# EAGLE design TempAndHumiditySensor (EAGLE 7.1.0)
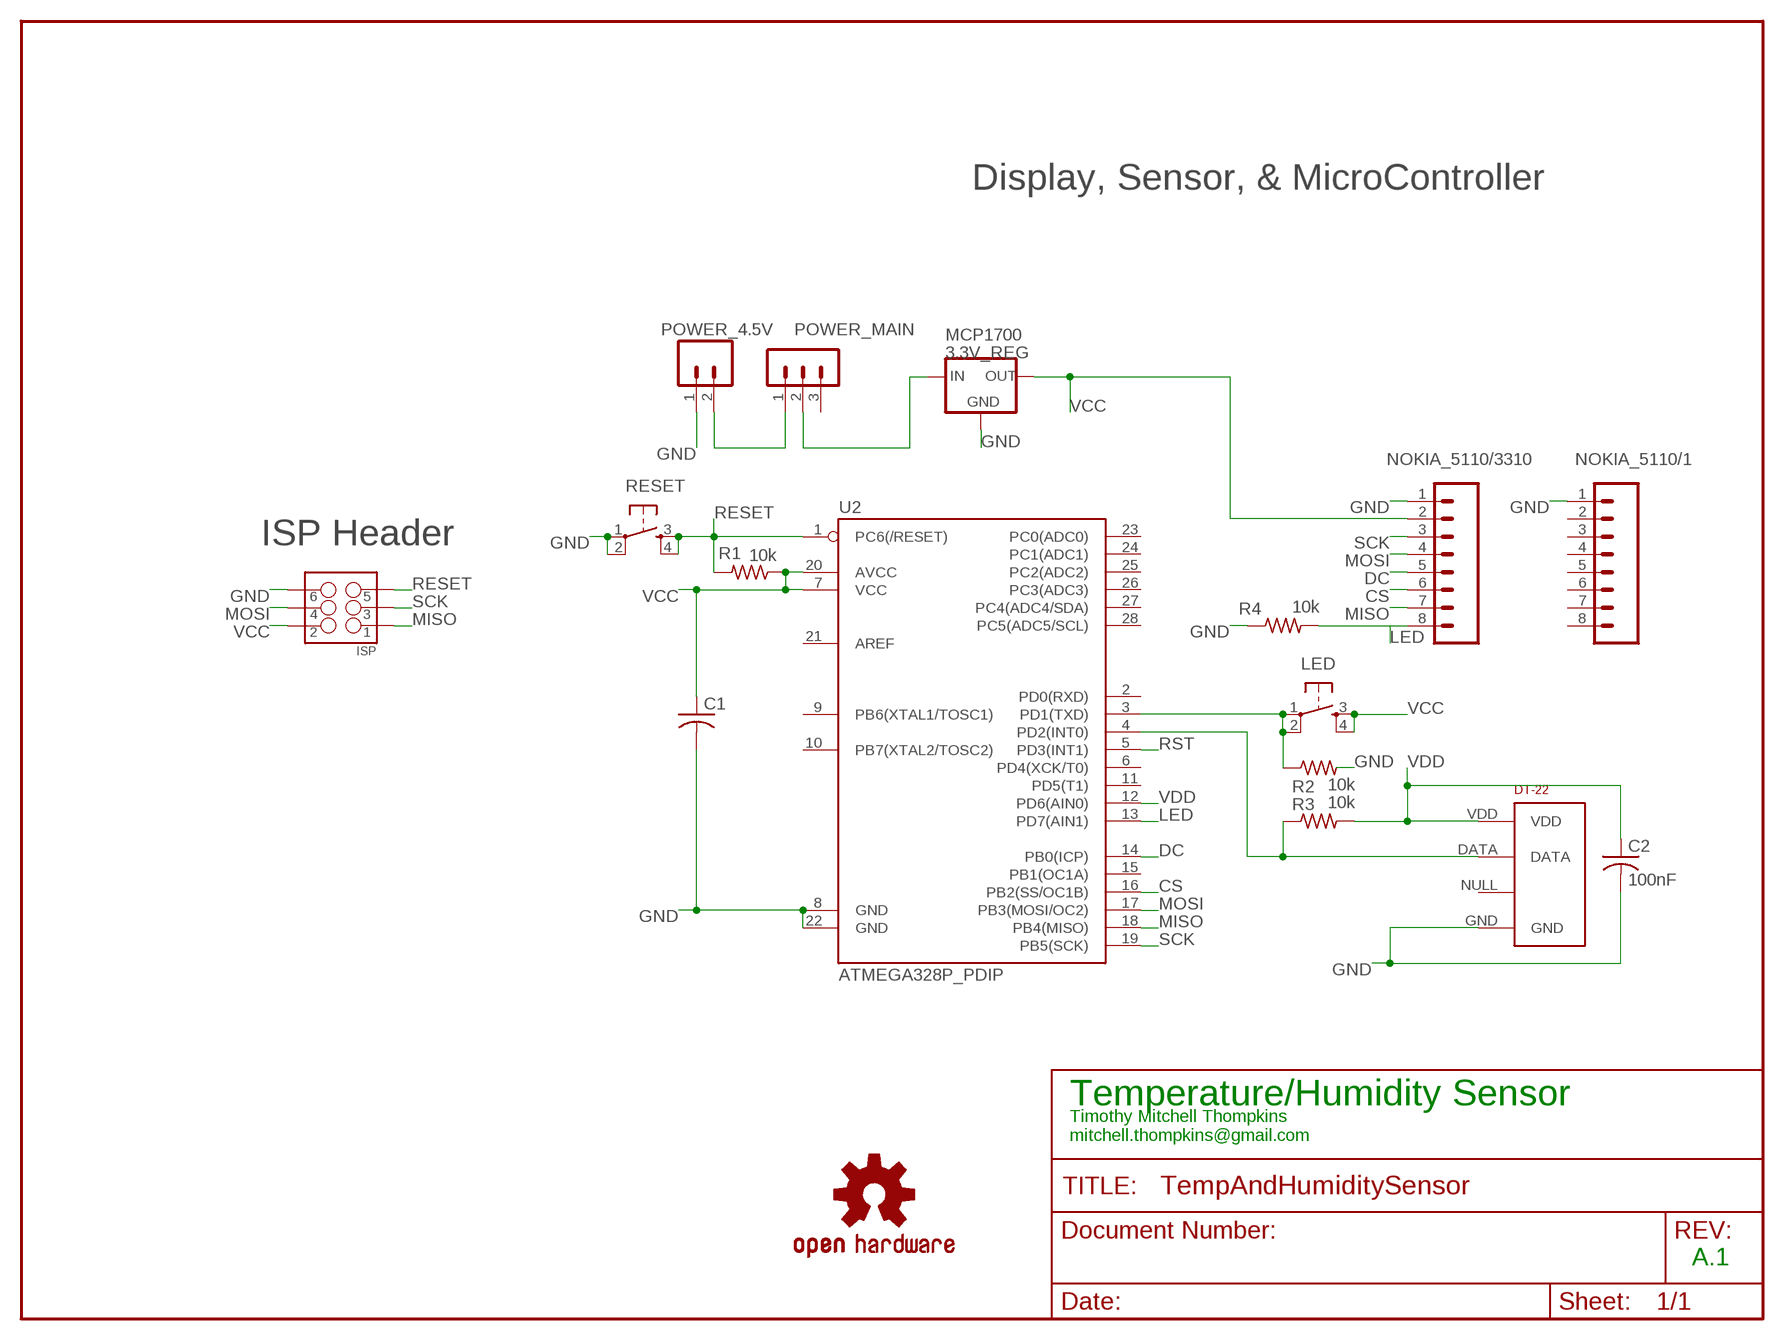
[diagram p0: schematic, sheet 1]

## Parts
C1  C-US025-040X050  [C025-040X050]
C2  100nF  C-US025-040X050  [C025-040X050]
DT-22  RHT03_DHT-22_AM2302RA  [RHT03_DHT-22/RA]
ISP  M03X2POGO_PINS  [2X3_POGO]
LED  RESET  TAC_SWITCHPTH  [TACTILE-PTH]
LOGO2  OSHW-LOGOS  [OSHW-LOGO-S]
MCP1700  3.3V_REG  MCP1700INLINE  [TO92-INLINE]
NOKIA_5110/1  M08  [1X08_PIN1_NO_SILK]
NOKIA_5110/3310  M08  [1X08_PIN1_NO_SILK]
POWER_4.5V  M02LOCK_LONGPADS  [1X02_LOCK_LONGPADS]
POWER_MAIN  MA03-1  [MA03-1]
R1  10k  R-US_0204/7  [0204/7]
R2  10k  R-US_0204/7  [0204/7]
R3  10k  R-US_0204/7  [0204/7]
R4  10k  R-US_0204/7  [0204/7]
RESET  RESET  TAC_SWITCHPTH  [TACTILE-PTH]
U2  ATMEGA328P_PDIP  [DIL28-3]

## Nets
CS: NOKIA_5110/3310.6 U2.16(PB2(SS/OC1B))
DC: NOKIA_5110/3310.5 U2.14(PB0(ICP))
GND: C1.2 C2.2 DT-22.GND ISP.P$6 MCP1700.1(GND) NOKIA_5110/1.1 NOKIA_5110/3310.1 POWER_4.5V.1 R2.2 R4.1 RESET.1 RESET.2 U2.8(GND) U2.22(GND)
LED: NOKIA_5110/3310.8 R4.2 U2.13(PD7(AIN1))
MISO: ISP.P$1 NOKIA_5110/3310.7 U2.18(PB4(MISO))
MOSI: ISP.P$4 NOKIA_5110/3310.4 U2.17(PB3(MOSI/OC2))
N$1: POWER_4.5V.2 POWER_MAIN.1
N$2: MCP1700.2(IN) POWER_MAIN.2
N$4: LED.1 LED.2 R2.1 U2.3(PD1(TXD))
N$5: DT-22.DATA R3.1 U2.4(PD2(INT0))
RESET: ISP.P$5 R1.2 RESET.3 RESET.4 U2.1(PC6(/RESET))
RST: U2.5(PD3(INT1))
SCK: ISP.P$3 NOKIA_5110/3310.3 U2.19(PB5(SCK))
VCC: C1.1 ISP.P$2 LED.3 LED.4 MCP1700.3(OUT) NOKIA_5110/3310.2 R1.1 U2.7(VCC) U2.20(AVCC)
VDD: C2.1 DT-22.VDD R3.2 U2.12(PD6(AIN0))
Unconnected: DT-22.NULL NOKIA_5110/1.2 NOKIA_5110/1.3 NOKIA_5110/1.4 NOKIA_5110/1.5 NOKIA_5110/1.6 NOKIA_5110/1.7 NOKIA_5110/1.8 POWER_MAIN.3 U2.2(PD0(RXD)) U2.6(PD4(XCK/T0)) U2.9(PB6(XTAL1/TOSC1)) U2.10(PB7(XTAL2/TOSC2)) U2.11(PD5(T1)) U2.15(PB1(OC1A)) U2.21(AREF) U2.23(PC0(ADC0)) U2.24(PC1(ADC1)) U2.25(PC2(ADC2)) U2.26(PC3(ADC3)) U2.27(PC4(ADC4/SDA)) U2.28(PC5(ADC5/SCL))

## Notes on the sheet
- Display, Sensor, & MicroController
- ISP Header
- Temperature/Humidity Sensor
- Timothy Mitchell Thompkins
  mitchell.thompkins@gmail.com
- A.1

## Library data of the parts
C1 C2 = adafruit:C-US: CAPACITOR, American symbol
DT-22 = DHT-22:RHT03_DHT-22_AM2302: RHT03 / DHT-22 / AM2302 Packages and symbol for the RHT03 / DHT-22 relative humidity and temperature sensor. Note: The AM2302 is a wired version of the DHT-22 which typically requires less clearance and is thus provided as a separate package.; PROD_ID: SEN-10167
ISP = SparkFun-Connectors:M03X2: 2x3 .1" header. Shrouded, with keying- CONN-10681 SMT- CONN-11415 Pogo pins- HW-11044; PROD_ID: HW-11044
LED RESET = SparkFun:TAC_SWITCH: Momentary Switch Button commonly used for reset or general input. Spark Fun Electronics SKU : COM-00097
LOGO2 = SparkFun-Aesthetics:OSHW-LOGO: Open Source Hardware Logo This logo indicates the piece of hardware it is found on incorporates a OSHW license and/or adheres to the definition of open source hardware found here: http://freedomdefined.org/OSHW
MCP1700 = adafruit:MCP1700: VOLTAGE REGULATOR
NOKIA_5110/1 NOKIA_5110/3310 = SparkFun-Connectors:M08: Header 8 Standard 8-pin 0.1" header. Use with straight break away headers (SKU : PRT-00116), right angle break away headers (PRT-00553), swiss pins (PRT-00743), machine pins (PRT-00117), and female headers (PRT-00115).
POWER_4.5V = SparkFun-Connectors:M02: Standard 2-pin 0.1" header. Use with - straight break away headers ( PRT-00116) - right angle break away headers (PRT-00553) - swiss pins (PRT-00743) - machine pins (PRT-00117) - female headers (PRT-00115) Molex polarized connector foot print use with: PRT-08233 with associated crimp pins and housings. 2.54_SCREWTERM for use with PRT-10571. 3.5mm Screw Terminal footprints for PRT-08084 5mm Screw Terminal footprints for use with PRT-08433
POWER_MAIN = con-lstb:MA03-1: PIN HEADER; OC_FARNELL: unknown; OC_NEWARK: unknown
R1-R4 = rcl:R-US_: RESISTOR, American symbol
U2 = SparkFun-DigitalIC:ATMEGA328P_PDIP: uC used in the Arduino 32kb flash, 1k EEPROM, 2k SRAM This is the through-hole version of this chip.

## Net classes
0 default: clearance 0.205 mm

## Board
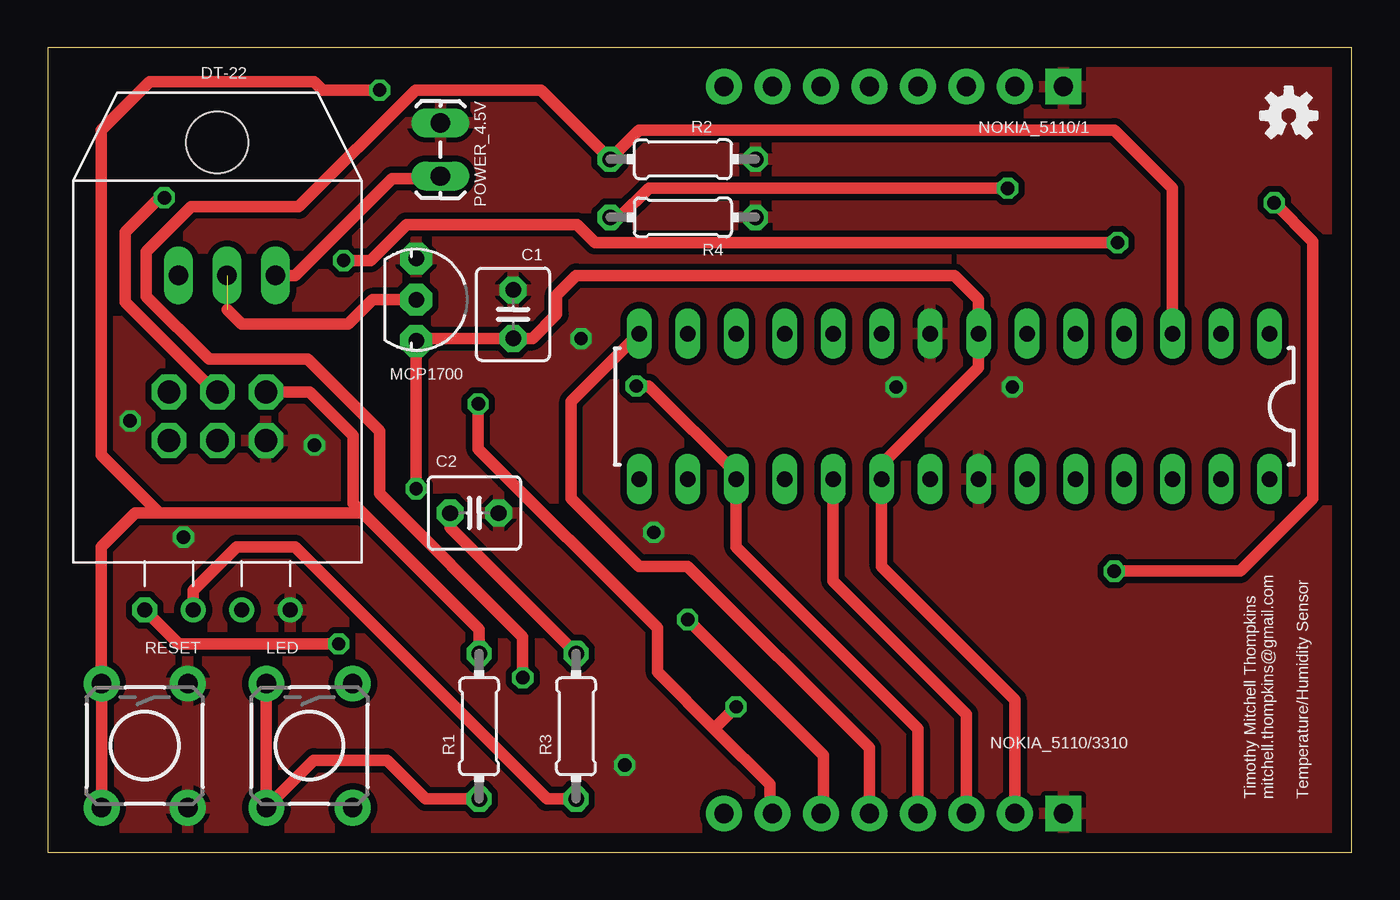
[diagram p1: board, top side]
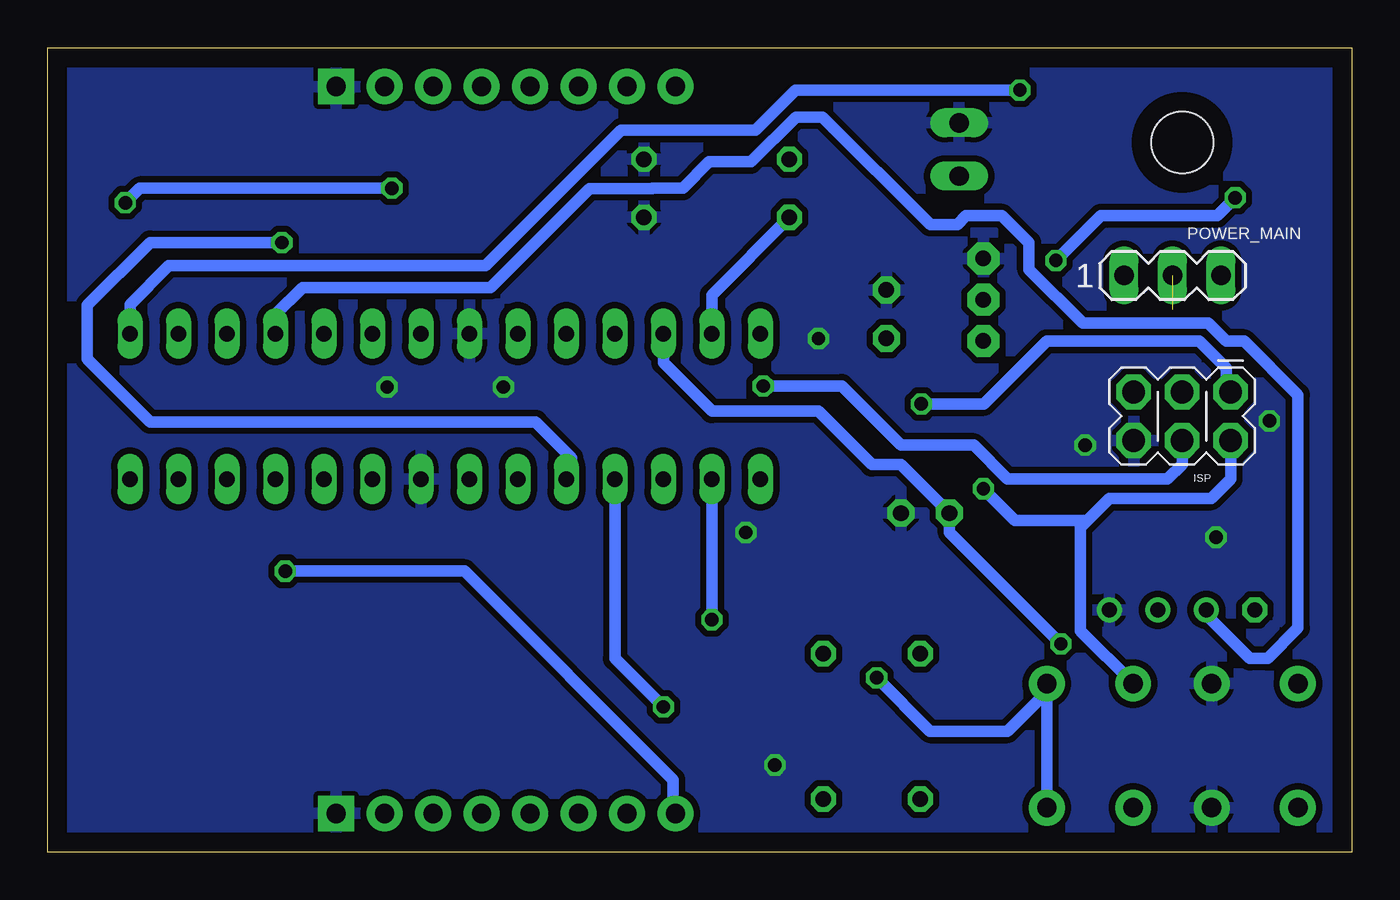
[diagram p2: board, bottom side, seen from below]

Size 68.33 x 42.16 mm. Coordinates in mm from the lower left corner, seen from the top.
Outline: 0,0 68.33,0 68.33,42.16 0,42.16 0,0
Copper layers (1*16): Top 0.035mm / dielectric 1.5mm / Bottom 0.035mm
Design rules "default *": minimum track width 24mil, minimum drill 24mil, track to track 13mil, track to pad 13mil, pad to pad 13mil, via to via 13mil, smd to smd 8mil, copper to edge 40mil, drill to drill 10mil, minimum pad ring 10mil, minimum via ring 8mil, stop-mask expansion 4mil, vias tented up to drill 0mil, thermal gap 10mil

### Footprints (pad centres in the part's own frame; a part is rotated, then mirrored left to right if it is on the bottom)
C025-040X050 = drill 0.813 pad 1.422 octagon: 1 -1.27,0; 2 1.27,0
RHT03_DHT-22/RA = drill 0.8: DATA -1.27,0; GND 3.81,0; NULL 1.27,0 | drill 0.8 octagon: VDD -3.81,0 | hole 3.25: 0,24.5
2X3_POGO = drill 1.2 pad 1.829 octagon: P$1 0,0; P$2 0,2.54; P$3 2.54,0; P$4 2.54,2.54; P$5 5.08,0; P$6 5.08,2.54
TACTILE-PTH = drill 1.016 pad 1.88: 1 -3.251,2.261; 2 3.251,2.261; 3 -3.251,-2.261; 4 3.251,-2.261
TO92-INLINE = drill 0.813 pad 1.676 octagon: 1 -2.159,0; 2 0,0; 3 2.159,0
1X08_PIN1_NO_SILK = drill 1.016 pad 1.88 square: 1 0,0 | drill 1.016 pad 1.88: 2 2.54,0; 3 5.08,0; 4 7.62,0; 5 10.16,0; 6 12.7,0; 7 15.24,0; 8 17.78,0
1X02_LOCK_LONGPADS = drill 1.016 long: 1 -0.127,0; 2 2.667,0
MA03-1 = drill 1.016 long: 1 -2.54,0; 2 0,0; 3 2.54,0
0204/7 = drill 0.813 octagon: 1 -3.81,0; 2 3.81,0
DIL28-3 = drill 0.813 long: 1 -16.51,-3.81; 2 -13.97,-3.81; 3 -11.43,-3.81; 4 -8.89,-3.81; 5 -6.35,-3.81; 6 -3.81,-3.81; 7 -1.27,-3.81; 8 1.27,-3.81; 9 3.81,-3.81; 10 6.35,-3.81; 11 8.89,-3.81; 12 11.43,-3.81; 13 13.97,-3.81; 14 16.51,-3.81; 15 16.51,3.81; 16 13.97,3.81; 17 11.43,3.81; 18 8.89,3.81; 19 6.35,3.81; 20 3.81,3.81; 21 1.27,3.81; 22 -1.27,3.81; 23 -3.81,3.81; 24 -6.35,3.81; 25 -8.89,3.81; 26 -11.43,3.81; 27 -13.97,3.81; 28 -16.51,3.81

### Placement (x,y rotation side)
C1  24.38,28.19 90 top
C2  22.35,17.78 0 top
DT-22  8.89,12.7 0 top
ISP  6.35,24.13 180 bottom
LED  13.72,5.59 270 top
LOGO2  65.02,38.61 0 top
MCP1700  19.3,28.96 270 top
NOKIA_5110/1  53.21,40.13 180 top
NOKIA_5110/3310  53.21,2.03 180 top
POWER_4.5V  20.57,38.1 270 top
POWER_MAIN  9.4,30.23 0 bottom
R1  22.61,6.6 90 top
R2  33.27,36.32 0 top
R3  27.69,6.6 90 top
R4  33.27,33.27 180 top
RESET  5.08,5.59 270 top
U2  47.5,23.37 180 top

### Tracks (layer width: path | path; a pad name or v marks a point on that pad's centre or on a via)
CS  (via drill 0.7)
  Top 0.61: NOKIA_5110/3310.6 40.64,2.16 40.64,5.08 v33.53,12.19
  Bottom 0.61: U2.16 v33.53,12.19
DC
  Top 0.61: U2.14 27.43,23.62 27.43,18.54 30.99,14.99 33.53,14.99 43.05,5.46 NOKIA_5110/3310.5
GND  (via drill 0.7 pad 0.81)
  other vias: 50.55,24.38 27.94,26.92 30.23,4.57 31.75,16.76 13.97,21.34 7.11,16.51 4.32,22.61 44.45,24.38
  pour Bottom: 0,0 68.33,0 68.33,42.16 0,42.16
  pour Top: 0,0 68.33,0 68.33,42.16 0,42.16
LED  (via drill 0.7 pad 0.81)
  Top 0.61: v50.29,34.8 31.5,34.8 29.97,33.27 R4.2 | v64.26,34.04 66.29,32 66.29,18.54 62.48,14.73 v55.88,14.73
  Bottom 0.61: NOKIA_5110/3310.8 35.56,2.16 35.56,3.81 46.48,14.73 v55.88,14.73 | v50.29,34.8 63.5,34.8 v64.26,34.04 | R4.2 33.53,29.21 U2.13
MISO  (via drill 0.7, 0.7 pad 0.81)
  Top 0.61: v22.55,23.5 22.55,21.14 31.95,11.75 31.95,9.45 35.05,6.35 | NOKIA_5110/3310.7 37.85,2.16 37.85,3.56 35.05,6.35 | v36.07,7.62 35.05,6.6 35.05,6.35
  Bottom 0.61: v22.55,23.5 19.27,23.5 15.98,26.78 7.99,26.78 6.58,25.38 6.58,24.43 ISP.P$1 | U2.18 38.61,10.16 v36.07,7.62
MOSI  (via drill 0.7)
  Top 0.61: v30.84,24.43 31.48,24.43 36.18,19.74 U2.17 36.07,16 45.59,6.48 NOKIA_5110/3310.4
  Bottom 0.61: v30.84,24.43 26.72,24.43 23.62,21.34 19.81,21.34 18.03,19.56 9.65,19.56 8.89,20.32 ISP.P$4
N$1
  Top 0.61: 20.45,35.31 18.03,35.31 12.95,30.23 POWER_MAIN.1
  Top 0.813: POWER_4.5V.2 20.45,35.31
N$2  (1 unrouted)
  Top 0.61: MCP1700.2 17.02,28.96 15.75,27.69 10.16,27.69 9.4,28.45
N$4  (via drill 0.7)
  Top 0.61: U2.3 58.93,34.8 55.88,37.85 30.99,37.85 R2.1 25.84,39.94 19.27,39.94 13.16,33.83 7.52,33.83 5.17,31.48 5.17,29.13 8.46,25.84 13.63,25.84 17.39,22.09 17.39,18.8 24.89,11.29 v24.89,9.14
  Bottom 0.61: LED.2 LED.1 15.98,8.41 18.03,6.35 22.1,6.35 v24.89,9.14
N$5
  Top 0.61: R3.1 26.16,2.79 12.95,16 9.91,16 7.62,13.72 DT-22.DATA
  Bottom 0.61: U2.4 56.39,28.19 54.98,29.6 45.11,29.6 39.94,34.77 36.65,34.77 36.63,34.8 35.05,34.8 33.67,36.18 31.48,36.18 29.13,38.53 27.72,38.53 22.09,32.89 20.68,32.89 20.21,33.36 18.33,33.36 16.92,31.95 16.92,30.54 14.1,27.72 7.52,27.72 6.58,26.78 5.64,26.78 2.82,23.96 2.82,11.75 4.41,10.16 5.33,10.16 7.62,12.45 DT-22.DATA
RESET  (via drill 0.7)
  Top 0.61: R1.2 22.61,11.68 16.51,17.78 | 16.51,17.78 16,18.29 16,21.84 13.72,24.13 ISP.P$5 | RESET.4 RESET.3 2.79,8.87 2.79,16 4.57,17.78 5.84,17.78 | 5.84,17.78 2.79,20.83 2.79,37.85 5.33,40.39 13.97,40.39 14.41,39.94 v17.39,39.94 | 5.84,17.78 16.51,17.78
  Bottom 0.61: v17.39,39.94 29.15,39.94 31.24,37.85 38.28,37.85 45.39,30.73 61.98,30.73 64.01,28.7 U2.1
SCK  (via drill 0.7)
  Top 0.61: U2.19 41.15,14.22 48.13,7.24 NOKIA_5110/3310.3 | v15.51,31.01 16.92,31.01 18.8,32.89 27.72,32.89 28.66,31.95 v56.06,31.95 | ISP.P$3 8.46,24.43 4.06,28.83 4.06,32.51 5.86,34.3 v6.11,34.3
  Bottom 0.61: v6.11,34.3 7.05,33.36 13.16,33.36 v15.51,31.01 | v56.06,31.95 62.97,31.95 66.26,28.66 66.26,25.84 62.97,22.55 42.76,22.55 40.88,20.68 40.88,19.74 U2.19
VCC  (via drill 0.7 pad 0.81)
  Top 0.61: 43.69,20.32 48.77,25.4 U2.7 48.77,28.96 47.5,30.23 27.69,30.23 26.67,29.21 26.67,28.19 25.4,26.92 C1.1 19.43,26.92 | U2.20 43.69,14.99 50.67,8 NOKIA_5110/3310.2 | LED.3 LED.4 13.95,4.83 17.78,4.83 19.81,2.79 R1.1 | MCP1700.3 v19.3,19.05
  Top 0.813: MCP1700.3 19.43,26.92 | 43.69,20.32 U2.20
  Bottom 0.61: LED.3 14.22,11.61 14.22,17.02 13.84,17.4 | 13.84,17.4 12.7,18.54 7.37,18.54 6.35,19.56 ISP.P$2 | v19.3,19.05 17.65,17.4 13.84,17.4
VDD  (via drill 0.7 pad 0.81)
  Top 0.61: R3.2 21.08,17.02 C2.1 | DT-22.VDD 6.86,10.92 v15.24,10.92
  Bottom 0.61: v15.24,10.92 21.08,16.76 C2.1 23.62,20.32 25.15,20.32 27.94,23.11 33.53,23.11 36.07,25.65 U2.12

### Text on the board
tPlace: Timothy Mitchell Thompkins / mitchell.thompkins@gmail.com / / Temperature/Humidity Sensor